# EAGLE design deeds-c3 (EAGLE 9.6.2)
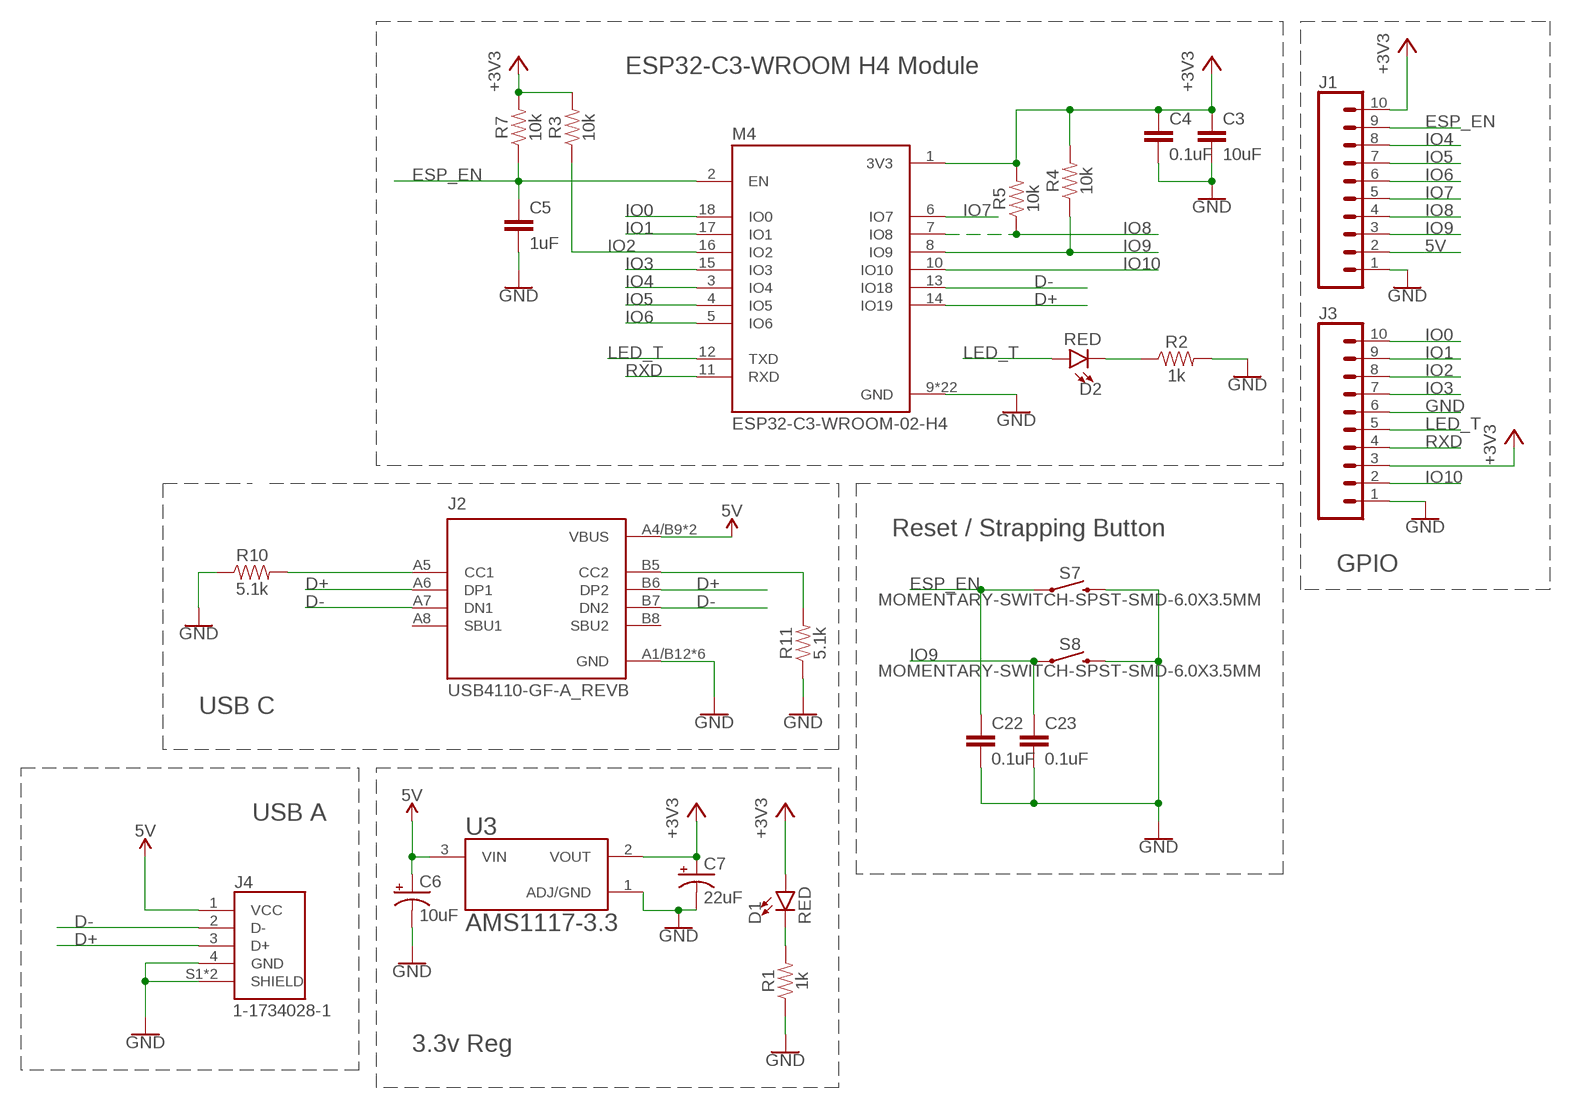
[diagram p0: schematic, sheet 1]

## Parts
C3  10uF  10UF-0603-6.3V-20%  [0603]
C4  0.1uF  10UF-0603-6.3V-20%  [0603]
C5  1uF  10UF-0603-6.3V-20%  [0603]
C6  10uF  10UF-POLAR-EIA3216-16V-10%(TANT)  [EIA3216]
C7  22uF  10UF-POLAR-EIA3216-16V-10%(TANT)  [EIA3216]
C22  0.1uF  0.1UF-0603-25V-(+80/-20%)  [0603]
C23  0.1uF  0.1UF-0603-25V-(+80/-20%)  [0603]
D1  RED  LED-RED0603  [LED-0603]
D2  RED  LED-RED0603  [LED-0603]
J1  CONN_10"  [1X10]
J2  USB4110-GF-A_REVB  [GCT_USB4110-GF-A_REVB]
J3  CONN_10"  [1X10]
J4  1-1734028-1  [TE_1-1734028-1]
M4  ESP32-C3-WROOM-02-H4  [MODULE_ESP32-C3-WROOM-02-H4]
R1  1k  1KOHM-0603-1/10W-1%  [0603]
R2  1k  1KOHM-0603-1/10W-1%  [0603]
R3  10k  1KOHM-0603-1/10W-1%  [0603]
R4  10k  1KOHM-0603-1/10W-1%  [0603]
R5  10k  1KOHM-0603-1/10W-1%  [0603]
R7  10k  1KOHM-0603-1/10W-1%  [0603]
R10  5.1k  1KOHM-0603-1/10W-1%  [0603]
R11  5.1k  1KOHM-0603-1/10W-1%  [0603]
S7  MOMENTARY-SWITCH-SPST-SMD-6.0X3.5MM  [TACTILE_SWITCH_SMD_6.0X3.5MM]
S8  MOMENTARY-SWITCH-SPST-SMD-6.0X3.5MM  [TACTILE_SWITCH_SMD_6.0X3.5MM]
U3  AMS1117-3.3  [SOT229P700X180-4N]

## Nets
5V: C6.+ J1.2 J2.A4/B9(VBUS) J2.B4/A9(VBUS) J4.1(VCC) U3.3(VIN)
+3V3: C3.1 C4.1 C7.+ D1.A J1.10 J3.3 M4.1(3V3) R3.2 R4.2 R5.2 R7.2 U3.2(VOUT)
D+: J2.A6(DP1) J2.B6(DP2) J4.3(D+) M4.14(IO19)
D-: J2.A7(DN1) J2.B7(DN2) J4.2(D-) M4.13(IO18)
ESP_EN: C5.1 C22.1 J1.9 M4.2(EN) R7.1 S7.1
GND: C3.2 C4.2 C5.2 C6.- C7.- C22.2 C23.2 J1.1 J2.A1/B12(GND) J2.B1/A12(GND) J2.S1(GND) J2.S2(GND) J2.S3(GND) J2.S4(GND) J3.1 J3.6 J4.4(GND) J4.S1(SHIELD) J4.S2(SHIELD) M4.9(GND) M4.19(GND) M4.20(GND) M4.21(GND) M4.22(GND) M4.23(GND) M4.24(GND) M4.25(GND) M4.26(GND) M4.27(GND) M4.28(GND) M4.29(GND) M4.30(GND) M4.31(GND) M4.32(GND) M4.33(GND) M4.34(GND) M4.35(GND) M4.36(GND) M4.37(GND) M4.38(GND) M4.39(GND) R1.1 R2.2 R10.1 R11.1 S7.2 S8.2 U3.1(ADJ/GND)
IO0: J3.10 M4.18(IO0)
IO1: J3.9 M4.17(IO1)
IO2: J3.8 M4.16(IO2) R3.1
IO3: J3.7 M4.15(IO3)
IO4: J1.8 M4.3(IO4)
IO5: J1.7 M4.4(IO5)
IO6: J1.6 M4.5(IO6)
IO7: J1.5 M4.6(IO7)
IO8: J1.4 M4.7(IO8) R5.1
IO9: C23.1 J1.3 M4.8(IO9) R4.1 S8.1
IO10: J3.2 M4.10(IO10)
LED_T: D2.A J3.5 M4.12(TXD)
N$1: D2.C R2.1
N$2: D1.C R1.2
N$5: J2.A5(CC1) R10.2
N$6: J2.B5(CC2) R11.2
RXD: J3.4 M4.11(RXD)
Unconnected: J2.A8(SBU1) J2.B8(SBU2)

## Notes on the sheet
- ESP32-C3-WROOM H4 Module
- Reset / Strapping Button
- GPIO
- USB C
- USB A
- 3.3v Reg

## Library data of the parts
C3 = SparkFun-Capacitors:10UF: 10.0µF ceramic capacitors A capacitor is a passive two-terminal electrical component used to store electrical energy temporarily in an electric field.; PROD_ID: CAP-11015
C4 C5 = SparkFun-Capacitors:10UF: 10.0µF ceramic capacitors A capacitor is a passive two-terminal electrical component used to store electrical energy temporarily in an electric field.; PROD_ID: CAP-11015; VALUE: 10uF
C6 = SparkFun-Capacitors:10UF-POLAR: 10.0µF polarized capacitors A capacitor is a passive two-terminal electrical component used to store electrical energy temporarily in an electric field.; PROD_ID: CAP-00811
C7 = SparkFun-Capacitors:10UF-POLAR: 10.0µF polarized capacitors A capacitor is a passive two-terminal electrical component used to store electrical energy temporarily in an electric field.; PROD_ID: CAP-00811; VALUE: 10uF
C22 C23 = SparkFun-Capacitors:0.1UF: 0.1µF ceramic capacitors A capacitor is a passive two-terminal electrical component used to store electrical energy temporarily in an electric field.; PROD_ID: CAP-00810
D1 D2 = SparkFun-LED:LED-RED: Red SMD LED Used in manufacturing of most products at SparkFun Packages: 0603 - SMD 0603 package [Product Link] <http://docs.avagotech.com/docs/AV02-0551EN> 0603 SMART - SMD 0603 SMART package ( more efficient and expensive)[Product Link] <http://www.osram-os.com/Graphics/XPic2/00077099_0.pdf> 1206 - SMD1206 package [Product Link] <https://www.sparkfun.com/datasheets/DevTools/LilyPad/Q150OVS4.pdff> SparkFun Products: Pro Mini 328 -5V <https://www.sparkfun.com/products/821> RedBoard <https://www.sparkfun.com/products/12757> IOIO-OTG <https://www.sparkfun.com/products/13613>; PROD_ID: DIO-00819
J1 J3 = SparkFun-Connectors:CONN_10: Multi connection point. Often used as Generic Header-pin footprint for 0.1 inch spaced/style header connections On any of the 0.1 inch spaced packages, you can populate with these: Break Away Headers - Straight <https://www.sparkfun.com/products/116> (PRT-00116) Break Away Male Headers - Right Angle <https://www.sparkfun.com/products/553> (PRT-00553) Female Headers <https://www.sparkfun.com/products/115> (PRT-00115) Break Away Headers - Machine Pin <https://www.sparkfun.com/products/117> (PRT-00117) Break Away Female Headers - Swiss Machine Pin <https://www.sparkfun.com/products/743> (PRT-00743) Arduino Stackable Header - 10 Pin <https://www.sparkfun.com/products/11376> (PRT-11376) For SCREWTERMINALS and SPRING TERMINALS visit here: Screw Terimnals on SparkFun.com <https://www.sparkfun.com/search/results?term=Screw+Terminals> (5mm/3.5mm/2.54mm spacing) This device is also useful as a general connection point to wire up your design to another part of your project. Our various solder wires solder well into these plated through hole pads. Hook-Up Wire - Assortment (Stranded, 22 AWG) <https://www.sparkfun.com/products/11375> (PRT-11375) Hook-Up Wire - Assortment (Solid Core, 22 AWG) <https://www.sparkfun.com/products/11367> (PRT-11367) View the entire wire category on our website here <https://www.sparkfun.com/categories/141> Special notes: Molex polarized connector foot print use with SKU : PRT-08231 with associated crimp pins and housings. 1MM SMD Version SKU: PRT-10208 NOTES ON THE VARIANTS LOCK and LOCK_LONGPADS... This footprint was designed to help hold the alignment of a through-hole component (i.e. 6-pin header) while soldering it into place. You may notice that each hole has been shifted either up or down by 0.005 of an inch from it's more standard position (which is a perfectly straight line). This slight alteration caused the pins (the squares in the middle) to touch the edges of the holes. Because they are alternating, it causes a "brace" to hold the component in place. 0.005 has proven to be the perfect amount of "off-center" position when using our standard breakaway headers. Although looks a little odd when you look at the bare footprint, once you have a header in there, the alteration is very hard to notice. Also,if you push a header all the way into place, it is covered up entirely on the bottom side.; PROD_ID: CONN-11563
J2 = USB4110-GF-A_REVB:USB4110-GF-A_REVB: Check prices <https://pricing.snapeda.com/parts/USB4110-GF-A/GCT/view-part?ref=eda>; AVAILABILITY: In Stock; DESCRIPTION: USB-C (USB TYPE-C) USB 2.0 Receptacle Connector 24 (16+8 Dummy) Position Surface Mount, Right Angle; Through Hole; MF: GCT; MP: USB4110-GF-A; PACKAGE: None; PRICE: None; PURCHASE-URL: https://pricing.snapeda.com/search/part/USB4110-GF-A/?ref=eda
J4 = 1-1734028-1:1-1734028-1: Conn USB 2.0 Type A PL 4 POS Solder RA SMD 4 Terminal 1 Port T/R Check prices <https://pricing.snapeda.com/parts/1-1734028-1/TE%20Connectivity/view-part?ref=eda>; AVAILABILITY: In Stock; CENTERLINE_PITCH: 2 mm[.078 in]; COMMENT: 1-1734028-1; DESCRIPTION: Conn USB 2.0 Type A PL 4 POS Solder RA SMD 4 Terminal 1 Port T/R; MF: TE Connectivity; MP: 1-1734028-1; NUMBER_OF_POSITIONS: 4; PACKAGE: None; PRICE: None; PRODUCT_TYPE: Connector; PURCHASE-URL: https://pricing.snapeda.com/search/part/1-1734028-1/?ref=eda
M4 = ESP32-C3-WROOM-02-H4:ESP32-C3-WROOM-02-H4: WiFi Modules (802.11) (Engineering Samples) SMD module, ESP32-C3, 4MB SPI flash, PCB antenna, -40 C +105 C Check prices <https://pricing.snapeda.com/parts/ESP32-C3-WROOM-02-H4/Espressif%20Systems/view-part?ref=eda>; AVAILABILITY: In Stock; DESCRIPTION: WiFi Modules (802.11) (Engineering Samples) SMD module, ESP32-C3, 4MB SPI flash, PCB antenna, -40 C +105 C; MF: Espressif Systems; MP: ESP32-C3-WROOM-02-H4; PACKAGE: VFQFN-32 Espressif Systems; PRICE: None; PURCHASE-URL: https://pricing.snapeda.com/search/part/ESP32-C3-WROOM-02-H4/?ref=eda
R1 R2 = SparkFun-Resistors:1KOHM: 1kΩ resistor A resistor is a passive two-terminal electrical component that implements electrical resistance as a circuit element. Resistors act to reduce current flow, and, at the same time, act to lower voltage levels within circuits. - Wikipedia; PROD_ID: RES-07856
R3-R5 R7 R10 R11 = SparkFun-Resistors:1KOHM: 1kΩ resistor A resistor is a passive two-terminal electrical component that implements electrical resistance as a circuit element. Resistors act to reduce current flow, and, at the same time, act to lower voltage levels within circuits. - Wikipedia; PROD_ID: RES-07856; VALUE: 1k
S7 S8 = SparkFun-Switches:MOMENTARY-SWITCH-SPST: Momentary Switch (Pushbutton) - SPST Normally-open (NO) SPST momentary switches (buttons, pushbuttons). Variants PTH-12MM - 12mm square, through-hole Momentary Pushbutton Switch - 12mm Square <https://www.sparkfun.com/products/9190> (COM-09190) PTH-6.0MM, PTH-6.0MM-KIT - 6.0mm square, through-hole Mini Pushbutton Switch <https://www.sparkfun.com/products/97> (COM-00097) KIT package intended for soldering kit's - only one side of pads' copper is exposed. PTH-RIGHT-ANGLE-KIT - Right-angle, through-hole Right Angle Tactile Button <https://www.sparkfun.com/products/10791> - Used on SparkFun BigTime Watch Kit <https://www.sparkfun.com/products/11734> SMD-12MM - 12mm square, surface-mount Tactile Button - SMD (12mm) <https://www.sparkfun.com/products/12993> (COM-12993) Used on SparkFun PicoBoard <https://www.sparkfun.com/products/11888> SMD-4.5MM - 4.5mm Square Trackball Switch Used on SparkFun Blackberry Trackballer Breakout <https://www.sparkfun.com/products/13169> SMD-4.6MMX2.8MM - 4.60mm x 2.80mm, surface mount Used on SparkFun SAMD21 Mini Breakout <https://www.sparkfun.com/products/13664> SMD-5.2MM, SMD-5.2-REDUNDANT - 5.2mm square, surface-mount Mini Pushbutton Switch - SMD <https://www.sparkfun.com/products/8720> (COM-08720) Used on Arduino Pro Mini <https://www.sparkfun.com/products/11114> REDUNDANT package connects both switch circuits together SMD-6.0X3.5MM - 6.0 x 3.5mm, surface mount Momentary Reset Switch SMD <https://www.sparkfun.com/products/8229> (COM-08229) SMD-6.2MM-TALL - 6.2mm square, surface mount Tactile Button - SMD (6mm) <https://www.sparkfun.com/products/12992> Used on SparkFun Digital Sandbox <https://www.sparkfun.com/products/12651> SMD-RIGHT-ANGLE - Right-angle, surface mount Used on SparkFun Block for Intel® Edison - Arduino <https://www.sparkfun.com/products/13036>; PROD_ID: SWCH-00815; SF_SKU: COM-08229
U3 = AMS1117-3.3:AMS1117-3.3: Sot223/Pkg 1-Amp 3.3-Volt Low Drop Out Voltage Regulatator Check prices <https://pricing.snapeda.com/parts/AMS1117-3.3/AMD/view-part?ref=eda>; AVAILABILITY: In Stock; DESCRIPTION: LDO Voltage Regulators 800MA LDO LINEAR REG; MF: AMD; MP: AMS1117-3.3; PACKAGE: None; PRICE: None

## Board
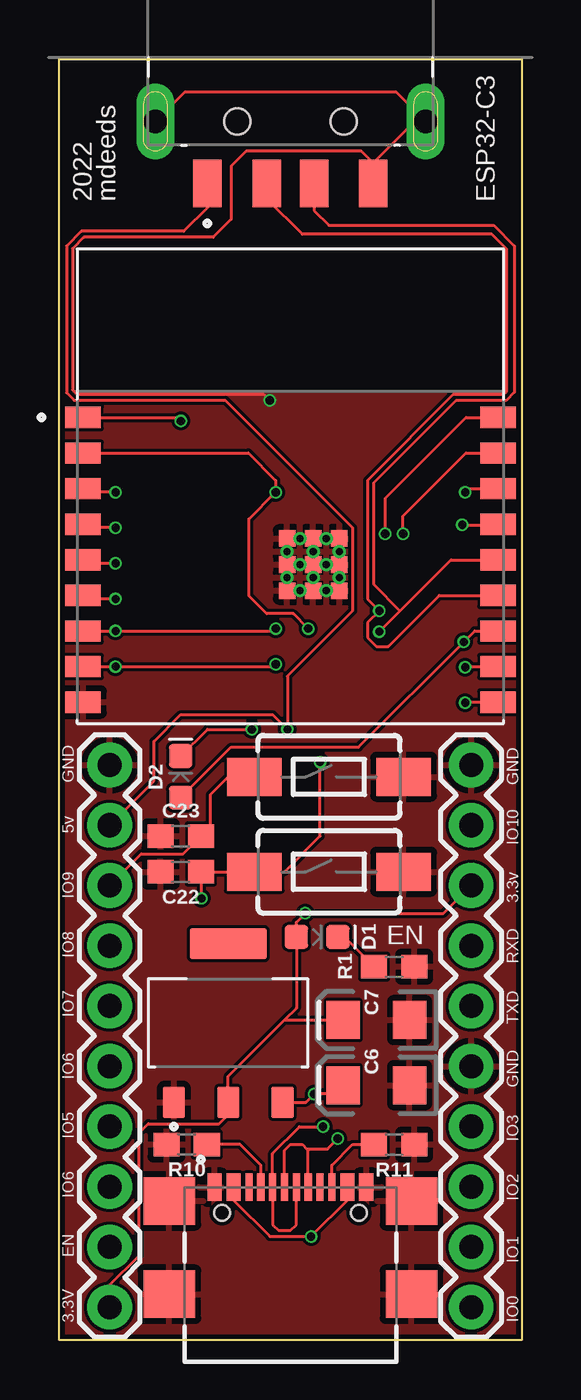
[diagram p1: board, top side]
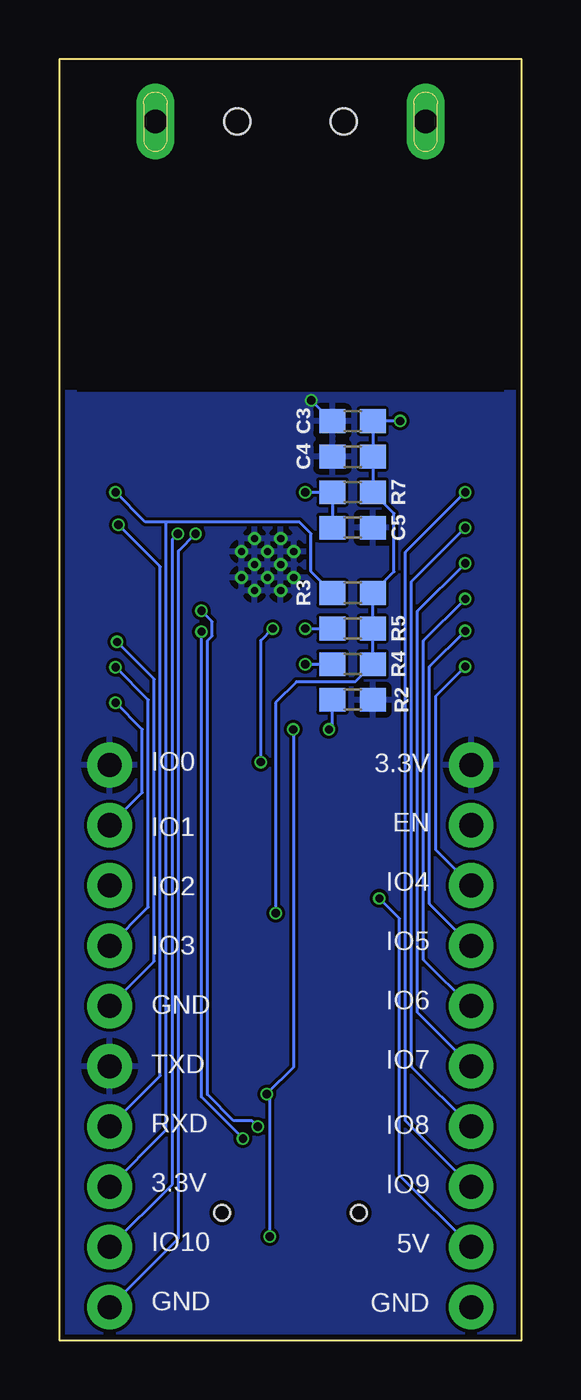
[diagram p2: board, bottom side, seen from below]

Size 19.5 x 54 mm. Coordinates in mm from the lower left corner, seen from the top.
Outline: 0,54 19.5,54 19.5,0 0,0 0,54
Copper layers (1*16): Top 0.035559375mm / dielectric 1.6mm / Bottom 0.035559375mm
Design rules "jlcpcb2layer": minimum track width 5mil, minimum drill 12mil, track to track 5mil, track to pad 5mil, pad to pad 5mil, via to via 5mil, smd to smd 5mil, copper to edge 8mil, drill to drill 6mil, minimum pad ring 5mil, minimum via ring 3mil, stop-mask expansion 2.5mil, vias tented up to drill 0mil, thermal gap 10mil

### Footprints (pad centres in the part's own frame; a part is rotated, then mirrored left to right if it is on the bottom)
0603 = smd 1.1 x 1: 1 -0.85,0; 2 0.85,0
EIA3216 = smd 1.4 x 1.6: + 1.4,0; - -1.4,0
LED-0603 = smd 1 x 1: A -0.877,0; C 0.877,0
1X10 = drill 1.016 pad 1.88: 1 0,0; 2 2.54,0; 3 5.08,0; 4 7.62,0; 5 10.16,0; 6 12.7,0; 7 15.24,0; 8 17.78,0; 9 20.32,0; 10 22.86,0
GCT_USB4110-GF-A_REVB = smd 0.6 x 1.15: A1/B12 -3.2,1.075; A4/B9 -2.4,1.075; B1/A12 3.2,1.075; B4/A9 2.4,1.075 | smd 0.3 x 1.15: A5 -1.25,1.075; A6 -0.25,1.075; A7 0.25,1.075; A8 1.25,1.075; B5 1.75,1.075; B6 0.75,1.075; B7 -0.75,1.075; B8 -1.75,1.075 | smd 2.18 x 2: S1 -5.11,0.5; S2 5.11,0.5; S3 -5.11,-3.43; S4 5.11,-3.43 | hole 0.65: -2.89,0; 2.89,0
TE_1-1734028-1 = smd 1.2 x 2: 1 3.5,2.6; 2 1,2.6; 3 -1,2.6; 4 -3.5,2.6 | drill 1 pad 1.6 long: S1 -5.7,0; S2 5.7,0 | hole 1.1: -2.25,0; 2.25,0
MODULE_ESP32-C3-WROOM-02-H4 = smd 1.5 x 0.9: 1 -8.75,2.9; 2 -8.75,1.4; 3 -8.75,-0.1; 4 -8.75,-1.6; 5 -8.75,-3.1; 6 -8.75,-4.6; 7 -8.75,-6.1; 8 -8.75,-7.6; 9 -8.75,-9.1; 10 8.75,-9.1; 11 8.75,-7.6; 12 8.75,-6.1; 13 8.75,-4.6; 14 8.75,-3.1; 15 8.75,-1.6; 16 8.75,-0.1; 17 8.75,1.4; 18 8.75,2.9 | smd 0.7 x 0.7: 19 -0.14,-2.2; 20 0.96,-2.2; 21 2.06,-2.2; 22 -0.14,-3.3; 23 0.96,-3.3; 24 2.06,-3.3; 25 -0.14,-4.4; 26 0.96,-4.4; 27 2.06,-4.4 | drill 0.3 pad 0.4: 28 0.41,-2.2; 29 1.51,-2.2; 30 -0.14,-2.75; 31 0.96,-2.75; 32 2.06,-2.75; 33 0.41,-3.3; 34 1.51,-3.3; 35 -0.14,-3.85; 36 0.96,-3.85; 37 2.06,-3.85; 38 0.41,-4.4; 39 1.51,-4.4
TACTILE_SWITCH_SMD_6.0X3.5MM = smd 2.3 x 1.6: 1 -3.15,0; 2 3.15,0
SOT229P700X180-4N = smd 0.93 x 1.31: 1 -2.29,-3.345; 2 0,-3.345; 3 2.29,-3.345 | smd 3.24 x 1.31: 4 0,3.345

### Placement (x,y rotation side)
C3  7.12,38.75 180 bottom
C4  7.12,37.25 180 bottom
C5  7.12,34.25 0 bottom
C6  13.38,10.75 180 top
C7  13.38,13.5 180 top
C22  5.12,19.75 180 top
C23  5.12,21.25 180 top
D1  10.88,17 0 top
D2  5.12,23.75 90 top
J1  2.12,24.25 270 top
J2  9.75,5.38 0 top
J3  17.38,24.25 270 top
J4  9.75,51.38 180 top
M4  9.75,36 0 top
R1  14.12,15.75 180 top
R2  7.12,27 0 bottom
R3  7.12,31.5 0 bottom
R4  7.12,28.5 0 bottom
R5  7.12,30 0 bottom
R7  7.12,35.75 0 bottom
R10  5.38,8.25 0 top
R11  14.12,8.25 180 top
S7  11.38,19.75 0 top
S8  11.38,23.75 0 top
U3  7.12,13.38 0 top

### Tracks (layer width: path | path; a pad name or v marks a point on that pad's centre or on a via)
5V  (via drill 0.35)
  Top 0.127: U3.3 10.4,10.03 v10.75,10.38 11.6,10.38 C6.+ | J2.A4/B9 7.35,5.9 8.88,4.37 v10.62,4.37 12.15,5.9 J2.B4/A9 | J1.2 4,23.59 4,25.25 5.12,26.38 9,26.38 v9.62,25.75 9.62,28 12.38,30.75 12.38,34.25 7,39.62 0.62,39.62 0.3,39.95 0.3,46.12 0.93,46.75 5.25,46.75 6.25,47.75 J4.1
  Bottom 0.127: v10.62,4.37 10.62,10.25 v10.75,10.38 9.62,11.5 v9.62,25.75
+3V3  (via drill 0.35)
  Top 0.127: M4.1 4.97,38.9 v5.12,38.75 | 9.5,13.5 C7.+ | 9.5,13.5 7.12,11.12 U3.2 7.12,9.5 6.75,9.12 3.75,9.12 3.36,8.73 3.36,3.57 2.12,2.33 J1.10 | 9.5,13.5 10,14 D1.A 10,17.62 v10.38,18 16.2,18 J3.3
  Bottom 0.127: v5.12,38.75 C3.1 C4.1 R7.2 5.38,34.85 5.38,32.4 R3.2 R5.2 R4.2 7.03,27.75 9.5,27.75 10.38,26.88 v10.38,18
D+  (via drill 0.35)
  Top 0.127: J2.A6 9.5,8 9.75,8.25 10.25,8.25 10.44,8.06 | 10.44,8.06 10.5,8 J2.B6 | 10.44,8.06 11.31,8.06 v11.75,8.5 | v13.5,29.88 14.38,30.75 | 14.38,30.75 16.52,32.9 M4.14 | J4.3 10.75,47.62 11.38,47 18.32,47 19.2,46.12 19.2,39.96 18.86,39.62 16.73,39.62 13.25,36.15 13.25,31.87 14.38,30.75
  Bottom 0.127: v11.75,8.5 13.5,10.25 v13.5,29.88
D-  (via drill 0.35)
  Top 0.127: J2.A7 10,4.88 9.75,4.62 9.25,4.62 9,4.88 J2.B7 9,7.88 10.12,9 v11.12,9 | M4.13 16.02,31.4 13.88,29.25 13.38,29.25 13,29.62 13,30.25 v13.5,30.75 13,31.25 13,36.25 16.62,39.88 18.75,39.88 18.88,40 18.88,46 18.25,46.62 10.25,46.62 8.75,48.12 J4.2
  Bottom 0.127: v11.12,9 11.38,9.25 12.14,9.25 13.25,10.36 13.25,29.49 13.05,29.69 13.05,30.3 v13.5,30.75
ESP_EN  (via drill 0.35)
  Top 0.127: M4.2 7.97,37.4 9.12,36.25 v9.12,35.75 8,34.62 8,31.38 8.75,30.62 9.88,30.62 v10.5,30 | v6,18.62 6,19.73 C22.1 S7.1 9.5,19.75 11,21.25 v11,24.38
  Bottom 0.127: v9.12,35.75 R7.1 C5.1 | J1.9 5.15,6.95 5.15,17.77 v6,18.62 | v11,24.38 11,29.5 v10.5,30
GND  (via drill 0.35)
  Top 0.127: v8.88,39.62 8.62,39.88 0.75,39.88 0.56,40.07 0.56,46.02 1.03,46.5 6.5,46.5 7.25,47.25 7.25,49.5 7.88,50.12 12.75,50.12 13.25,49.62 J4.4 13.25,49.65 14.97,51.38 J4.S1 14.2,52.62 5.3,52.62 J4.S2
  Bottom 0.127: v8.88,39.62 8,38.75 C3.2
  pour Bottom: -0.88,-0.25 27.12,-0.25 27.12,40 -0.88,40
  pour Top: -1.12,40 27.38,40 27.38,-0.5 -1.12,-0.5
IO0  (via drill 0.35)
  Top 0.127: v13.75,34 13.75,35.5 17.15,38.9 M4.18
  Bottom 0.127: J3.10 14.48,4.29 14.48,33.27 v13.75,34
IO1  (via drill 0.35)
  Top 0.127: v14.5,34 14.5,34.75 17.15,37.4 M4.17
  Bottom 0.127: J3.9 14.73,6.58 14.73,33.77 v14.5,34
IO2  (via drill 0.35)
  Top 0.127: v17.12,35.75 17.27,35.9 M4.16
  Bottom 0.127: R3.1 8.88,32.4 8.88,34 9.38,34.5 15,34.5 | v17.12,35.75 15.88,34.5 15,34.5 | J3.8 14.98,8.86 14.98,34.48 15,34.5
IO3  (via drill 0.35)
  Top 0.127: v17,34.38 18.48,34.38 M4.15
  Bottom 0.127: J3.7 15.24,11.15 15.24,32.61 v17,34.38
IO4  (via drill 0.35)
  Top 0.127: v2.38,35.75 1.15,35.75 M4.3
  Bottom 0.127: J1.8 4.89,9.24 4.89,33.23 v2.38,35.75
IO5  (via drill 0.35)
  Top 0.127: v2.38,34.25 1.15,34.25 M4.4
  Bottom 0.127: J1.7 4.64,11.53 4.64,31.98 v2.38,34.25
IO6  (via drill 0.35)
  Top 0.127: v2.38,32.75 1.15,32.75 M4.5
  Bottom 0.127: J1.6 4.39,13.81 4.39,30.74 v2.38,32.75
IO7  (via drill 0.35)
  Top 0.127: v2.38,31.25 1.15,31.25 M4.6
  Bottom 0.127: J1.5 2.18,14.09 4.13,16.04 4.13,29.49 v2.38,31.25
IO8  (via drill 0.35)
  Top 0.127: M4.7 v2.38,29.9 9.03,29.9 v9.12,30
  Bottom 0.127: v9.12,30 R5.1 | J1.4 3.88,18.38 3.88,28.4 v2.38,29.9
IO9  (via drill 0.35)
  Top 0.127: J1.3 3.46,20.5 5.22,20.5 C23.1 6.38,21.65 6.38,23 7.12,23.75 S8.1 | M4.8 v2.38,28.4 9.03,28.4 v9.12,28.5
  Bottom 0.127: v9.12,28.5 R4.1 | J1.3 3.62,20.67 3.62,27.15 v2.38,28.4
IO10  (via drill 0.35)
  Top 0.127: v17.12,26.88 17.15,26.9 M4.10
  Bottom 0.127: J3.2 16,23.09 16,25.75 v17.12,26.88
LED_T  (via drill 0.35)
  Top 0.127: D2.A 7.25,25 12.62,25 v17.06,29.44 17.52,29.9 M4.12
  Bottom 0.127: J3.5 15.49,15.97 15.49,27.87 v17.06,29.44
N$1  (via drill 0.35)
  Top 0.127: D2.C 6.25,25.75 v8.12,25.75
  Bottom 0.127: v8.12,25.75 7.97,25.9 R2.1
N$2
  Top 0.127: R1.2 12.03,17 D1.C
N$5
  Top 0.127: J2.A5 8.5,7.38 7.62,8.25 R10.2
N$6
  Top 0.127: J2.B5 11.5,7.38 12.38,8.25 R11.2
RXD  (via drill 0.35)
  Top 0.127: v17.12,28.38 17.15,28.4 M4.11
  Bottom 0.127: J3.4 15.75,18.26 15.75,27 v17.12,28.38

### Text on the board
tPlace: 2022 | mdeeds | ESP32-C3 | GND | GND | IO10 | 5v | 3.3v | IO9 | EN | RXD | IO8 | TXD | IO7 | GND | IO6 | IO3 | IO5 | IO2 | IO6 | EN | IO1 | IO0 | 3.3V
bPlace: 3.3V | IO0 | EN | IO1 | IO4 | IO2 | IO5 | IO3 | IO6 | GND | IO7 | TXD | IO8 | RXD | IO9 | 3.3V | 5V | IO10 | GND | GND